# EasyEDA Pro project ProPrj_cap banks_2026-02-15.epro, board PCB1_1
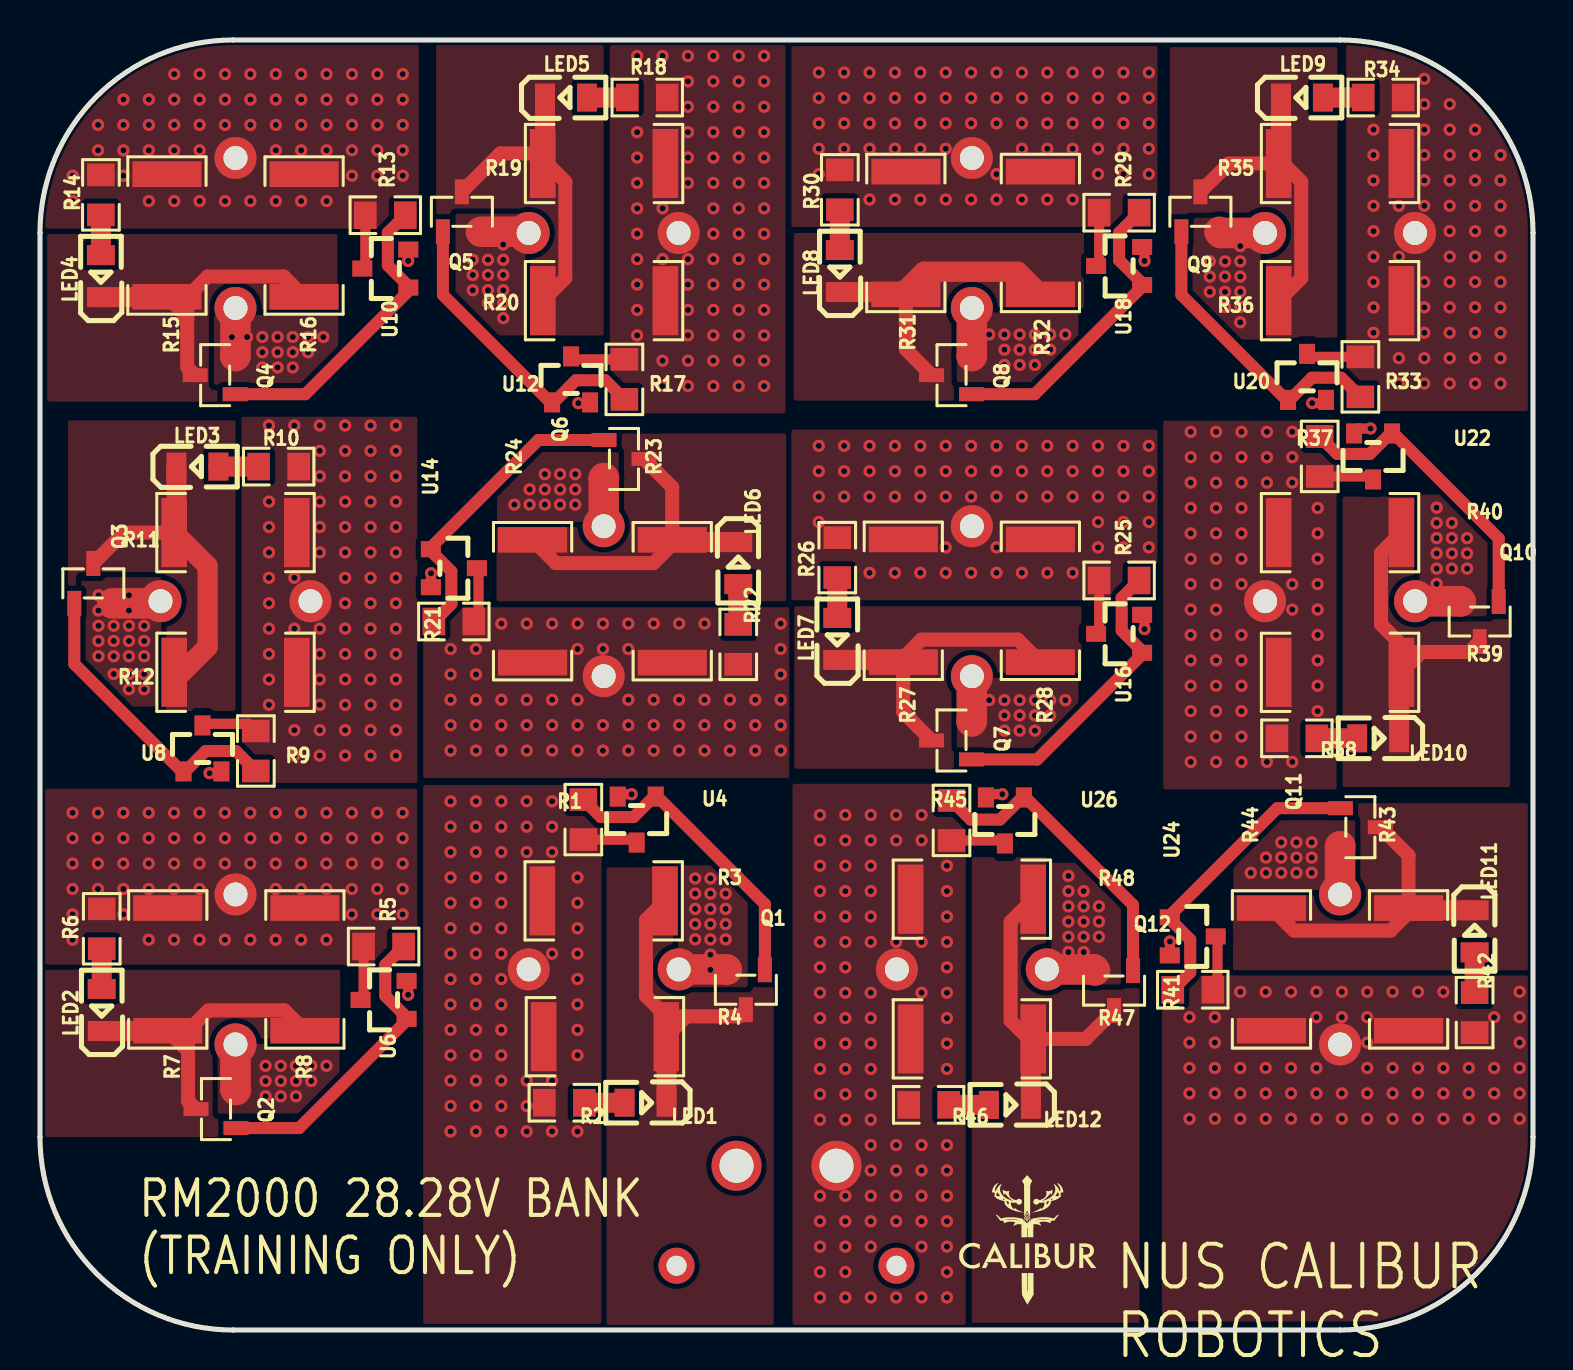
[diagram p4: board, top side]
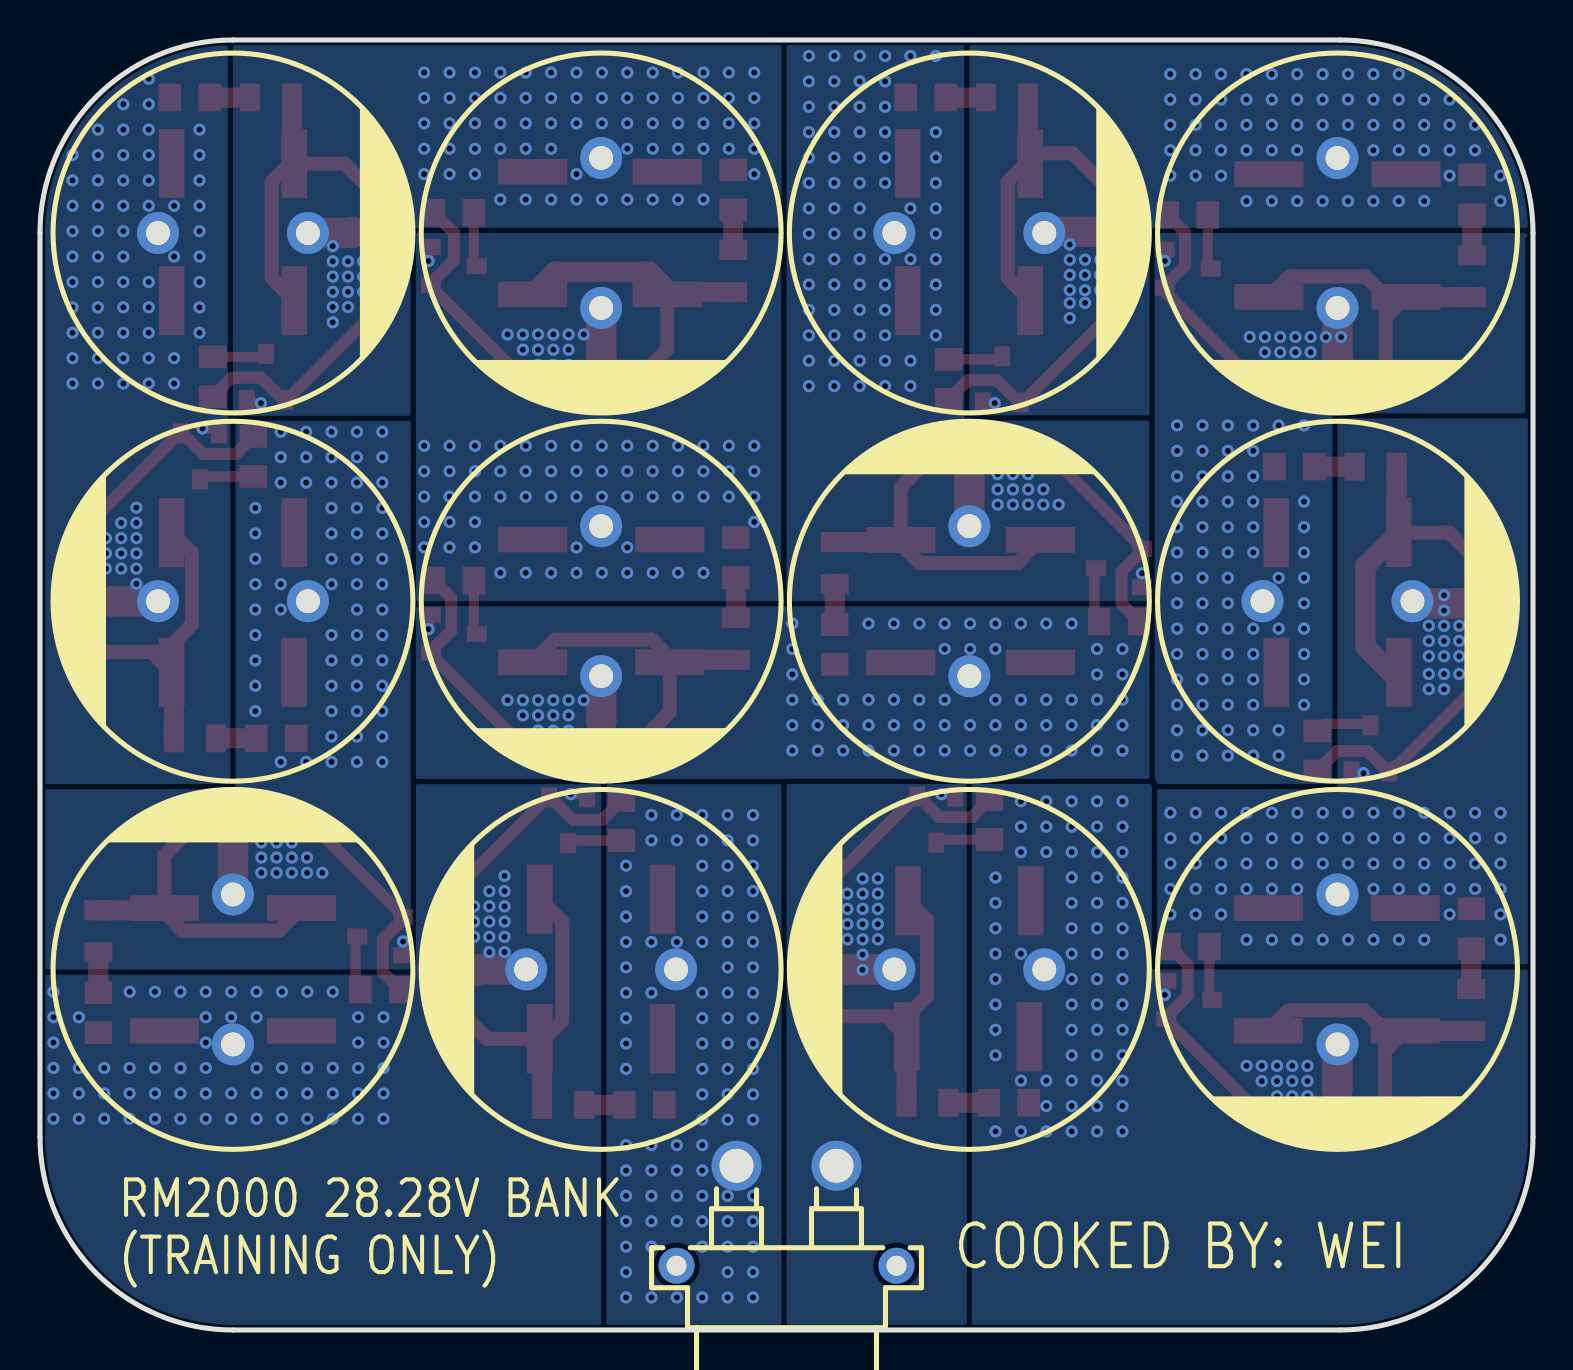
[diagram p5: board, bottom side, seen from below]

Outline 74.68 x 64.52 mm; copper layers: Top Layer, Bottom Layer. Coordinates in mm from the lower left corner of the outline.
Outline path: 0,54.86 0,9.65 arc(2.83,2.83) 9.65,0 65.02,0 arc(71.85,2.83) 74.68,9.65 74.68,54.86 arc(71.85,61.69) 65.02,64.52 9.65,64.52 arc(2.83,61.69) 0,54.86
Stack: Top Layer 0.035mm / Dielectric1 1.51mm FR4 er 4.5 / Bottom Layer 0.035mm

## Design rules (mm)
template: Custom Config
spacing copperThickness1oz (default): track to track 0.102, other pairs 0.152 to 0.3
spacing copperThickness2oz: track to track 0.203, other pairs 0.152 to 0.3
track width copperThickness1oz (default): min 0.127, default 0.508, max 2.54
track width copperThickness2oz: min 0.203, default 0.254, max 2.54
differential pair differentialPair (default): width min 0.127, default 0.254, max 2.54; gap min 0.152, default 0.152
via viaSize (default): diameter min 0.5, default 0.61, max 10; hole min 0.3, default 0.305, max 6.3
net $1N732 uses copperRegion1
net GND uses copperRegion1
net $1N2021 uses copperRegion1
net $1N2373 uses copperRegion1
net $1N2722 uses copperRegion1
net $1N3071 uses copperRegion1
net $1N3399 uses copperRegion1
net $1N3727 uses copperRegion1
net $1N4055 uses copperRegion1
net $1N4383 uses copperRegion1
net $1N4711 uses copperRegion1
net $1N5039 uses copperRegion1
net $1N5367 uses copperRegion1
net $1N3072 uses copperRegion1
net VCC uses copperRegion1
net NET1 uses copperRegion1
net NET2 uses copperRegion1
net NET3 uses copperRegion1
net NET4 uses copperRegion1
net NET5 uses copperRegion1
net NET6 uses copperRegion1
net NET7 uses copperRegion1
net NET8 uses copperRegion1
net NET9 uses copperRegion1
net NET10 uses copperRegion1
net NET11 uses copperRegion1

## Placement (name value [footprint] x y rotation side)
LED1  NCD0805R1  [LED0805-R-RD]  30.29 11.37 180 top
LED2  NCD0805R1  [LED0805-R-RD]  3.09 16 90 top
LED3  NCD0805R1  [LED0805-R-RD]  7.87 43.18 0 top
LED4  NCD0805R1  [LED0805-R-RD]  3.05 52.7 90 top
LED5  NCD0805R1  [LED0805-R-RD]  26.31 61.64 0 top
LED6  NCD0805R1  [LED0805-R-RD]  34.92 38.35 270 top
LED7  NCD0805R1  [LED0805-R-RD]  39.88 34.56 90 top
LED8  NCD0805R1  [LED0805-R-RD]  40.01 52.96 90 top
LED9  NCD0805R1  [LED0805-R-RD]  63.12 61.64 0 top
LED10  NCD0805R1  [LED0805-R-RD]  66.93 29.59 180 top
LED11  NCD0805R1  [LED0805-R-RD]  71.76 19.94 270 top
LED12  NCD0805R1  [LED0805-R-RD]  48.51 11.26 180 top
Q1  HL3400  [SOT-23-3_L2.9-W1.3-P1.90-LS2.4-BR]  35.31 17.02 90 top
Q2  HL3400  [SOT-23-3_L2.9-W1.3-P1.90-LS2.4-BR]  8.8 11.05 0 top
Q3  HL3400  [SOT-23-3_L2.9-W1.3-P1.90-LS2.4-BR]  2.67 37.34 270 top
Q4  HL3400  [SOT-23-3_L2.9-W1.3-P1.90-LS2.4-BR]  8.76 47.75 0 top
Q5  HL3400  [SOT-23-3_L2.9-W1.3-P1.90-LS2.4-BR]  21.1 55.92 270 top
Q6  HL3400  [SOT-23-3_L2.9-W1.3-P1.90-LS2.4-BR]  29.21 43.56 180 top
Q7  HL3400  [SOT-23-3_L2.9-W1.3-P1.90-LS2.4-BR]  45.59 29.48 0 top
Q8  HL3400  [SOT-23-3_L2.9-W1.3-P1.90-LS2.4-BR]  45.59 47.75 0 top
Q9  HL3400  [SOT-23-3_L2.9-W1.3-P1.90-LS2.4-BR]  58.04 55.92 270 top
Q10  HL3400  [SOT-23-3_L2.9-W1.3-P1.90-LS2.4-BR]  72.01 35.43 90 top
Q11  HL3400  [SOT-23-3_L2.9-W1.3-P1.90-LS2.4-BR]  66.04 25.15 180 top
Q12  HL3400  [SOT-23-3_L2.9-W1.3-P1.90-LS2.4-BR]  53.72 16.97 90 top
R1  30kΩ  [R0805]  27.18 25.53 270 top
R2  100Ω  [R0805]  26.23 11.37 180 top
R3  2Ω  [R2512]  28.19 21.46 180 top
R4  2Ω  [R2512]  28.26 14.67 180 top
R5  30kΩ  [R0805]  17.19 19.18 180 top
R6  100Ω  [R0805]  3.09 20.07 90 top
R7  2Ω  [R2512]  6.39 18.03 90 top
R8  2Ω  [R2512]  13.25 18.03 90 top
R9  30kΩ  [R0805]  10.8 28.96 90 top
R10  100Ω  [R0805]  11.94 43.18 0 top
R11  2Ω  [R2512]  9.78 39.88 0 top
R12  2Ω  [R2512]  9.78 32.89 0 top
R13  30kΩ  [R0805]  17.27 55.75 180 top
R14  100Ω  [R0805]  3.05 56.77 90 top
R15  2Ω  [R2512]  6.35 54.74 90 top
R16  2Ω  [R2512]  13.21 54.74 90 top
R17  30kΩ  [R0805]  29.23 47.54 90 top
R18  100Ω  [R0805]  30.37 61.64 0 top
R19  2Ω  [R2512]  28.21 58.34 0 top
R20  2Ω  [R2512]  28.21 51.48 0 top
R21  30kΩ  [R0805]  20.7 35.43 0 top
R22  100Ω  [R0805]  34.92 34.29 270 top
R23  2Ω  [R2512]  31.62 36.45 270 top
R24  2Ω  [R2512]  24.64 36.45 270 top
R25  30kΩ  [R0805]  53.97 37.48 180 top
R26  100Ω  [R0805]  39.88 38.63 90 top
R27  2Ω  [R2512]  43.18 36.47 90 top
R28  2Ω  [R2512]  50.04 36.47 90 top
R29  30kΩ  [R0805]  53.98 55.88 180 top
R30  100Ω  [R0805]  40.01 57.02 90 top
R31  2Ω  [R2512]  43.31 54.86 90 top
R32  2Ω  [R2512]  50.04 54.86 90 top
R33  30kΩ  [R0805]  66.04 47.67 90 top
R34  100Ω  [R0805]  67.18 61.64 0 top
R35  2Ω  [R2512]  65.02 58.34 0 top
R36  2Ω  [R2512]  65.02 51.48 0 top
R37  30kΩ  [R0805]  64.01 43.69 270 top
R38  100Ω  [R0805]  62.86 29.59 180 top
R39  2Ω  [R2512]  65.02 32.89 180 top
R40  2Ω  [R2512]  65.02 39.88 180 top
R41  30kΩ  [R0805]  57.66 17.02 0 top
R42  100Ω  [R0805]  71.76 15.87 270 top
R43  2Ω  [R2512]  68.45 18.03 270 top
R44  2Ω  [R2512]  61.6 18.03 270 top
R45  30kΩ  [R0805]  45.59 25.48 270 top
R46  100Ω  [R0805]  44.45 11.26 180 top
R47  2Ω  [R2512]  46.61 14.56 180 top
R48  2Ω  [R2512]  46.61 21.55 180 top
U1  XT30PW-F20.G.Y  [CONN-TH_XT30PW-F-1]  37.34 5.72 180 bottom
U2  1500uF  [CAP-TH_BD18.0-P7.50-D0.8-FD]  28.19 18.03 0 bottom
U4  LN61CN2402MR-G  [SOT-23_L2.9-W1.3-P1.90-LS2.4-BR]  29.85 25.53 90 top
U5  1500uF  [CAP-TH_BD18.0-P7.50-D0.8-FD]  9.78 18.03 270 bottom
U6  LN61CN2402MR-G  [SOT-23_L2.9-W1.3-P1.90-LS2.4-BR]  17.19 16.51 0 top
U7  1500uF  [CAP-TH_BD18.0-P7.50-D0.8-FD]  9.78 36.45 180 bottom
U8  LN61CN2402MR-G  [SOT-23_L2.9-W1.3-P1.90-LS2.4-BR]  8.13 29.08 270 top
U9  1500uF  [CAP-TH_BD18.0-P7.50-D0.8-FD]  9.78 54.86 270 bottom
U10  LN61CN2402MR-G  [SOT-23_L2.9-W1.3-P1.90-LS2.4-BR]  17.27 53.09 0 top
U11  1500uF  [CAP-TH_BD18.0-P7.50-D0.8-FD]  28.19 54.86 180 bottom
U12  LN61CN2402MR-G  [SOT-23_L2.9-W1.3-P1.90-LS2.4-BR]  26.56 47.54 270 top
U13  1500uF  [CAP-TH_BD18.0-P7.50-D0.8-FD]  28.19 36.45 90 bottom
U14  LN61CN2402MR-G  [SOT-23_L2.9-W1.3-P1.90-LS2.4-BR]  20.7 38.1 180 top
U15  1500uF  [CAP-TH_BD18.0-P7.50-D0.8-FD]  46.61 36.45 270 bottom
U16  LN61CN2402MR-G  [SOT-23_L2.9-W1.3-P1.90-LS2.4-BR]  53.97 34.82 0 top
U17  1500uF  [CAP-TH_BD18.0-P7.50-D0.8-FD]  46.61 54.86 270 bottom
U18  LN61CN2402MR-G  [SOT-23_L2.9-W1.3-P1.90-LS2.4-BR]  53.98 53.21 0 top
U19  1500uF  [CAP-TH_BD18.0-P7.50-D0.8-FD]  65.02 54.86 180 bottom
U20  LN61CN2402MR-G  [SOT-23_L2.9-W1.3-P1.90-LS2.4-BR]  63.37 47.67 270 top
U21  1500uF  [CAP-TH_BD18.0-P7.50-D0.8-FD]  65.02 36.45 0 bottom
U22  LN61CN2402MR-G  [SOT-23_L2.9-W1.3-P1.90-LS2.4-BR]  66.67 43.69 90 top
U23  1500uF  [CAP-TH_BD18.0-P7.50-D0.8-FD]  65.02 18.03 90 bottom
U24  LN61CN2402MR-G  [SOT-23_L2.9-W1.3-P1.90-LS2.4-BR]  57.66 19.68 180 top
U25  1500uF  [CAP-TH_BD18.0-P7.50-D0.8-FD]  46.61 18.03 0 bottom
U26  LN61CN2402MR-G  [SOT-23_L2.9-W1.3-P1.90-LS2.4-BR]  48.26 25.48 90 top

## Footprints (pads in the part's own frame, mm; a bottom-side part is the same pattern mirrored in y, then rotated)
CAP-TH_BD18.0-P7.50-D0.8-FD
  round 2.1 hole 1.2: 1(-3.75,0) 2(3.75,0)
CONN-TH_XT30PW-F-1
  round 2.5 hole 1.7: 1(-2.5,2.5) 2(2.5,2.5)
  round 1.8 hole 1: 3(5.5,-2.5) 4(-5.5,-2.5)
LED0805-R-RD
  rect 1x1.399 smd: 1(1.05,0) 2(-1.05,0)
R0805
  rect 1.133x1.377 smd: 1(-1,0) 2(1,0)
R2512
  rect 1.282x3.456 smd: 1(-3.067,0) 2(3.067,0)
SOT-23-3_L2.9-W1.3-P1.90-LS2.4-BR
  rect 1.25x0.7 smd: 1(1,-0.95) 2(1,0.95) 3(-1,0)
SOT-23_L2.9-W1.3-P1.90-LS2.4-BR
  rect 1x0.8 smd: 1(1.15,-0.95) 2(1.15,0.95) 3(-1.15,0)

## Nets
As in the schematic.

Pads without a net: U1 3 4

## Via types
v1: diameter 0.61, hole 0.305, Top Layer to Bottom Layer, 962 vias

## Routing (per net, layer and track width the routed paths; a pad name or vN(x,y) marks a point on that pad's centre or on a via; arc(x,y) is an arc through that point)
GND: length 3.1
  Top Layer w0.508: 28.89,26.76 28.93,26.8 v1(29.59,26.8)
  Top Layer w1.524: U2.2 34.34,18.03 Q1.2
  vias: v1(32.77,22.58) v1(32.77,21.82) v1(32.77,21.06) v1(32.77,20.3) v1(32.77,19.54) v1(33.53,22.58) v1(33.53,21.82) v1(33.53,21.06) v1(33.53,20.3) v1(33.53,19.54) v1(33.53,18.77) v1(33.53,18.01) v1(34.29,21.82) v1(34.29,21.06) v1(34.29,20.3) v1(34.29,19.54)
VCC: length 2.8
  Top Layer w0.508: R45.2 48.02,24.48 48.26,24.25
  vias: v1(39.01,25.76) v1(39.01,24.49) v1(39.01,23.22) v1(39.01,21.95) v1(39.01,20.68) v1(39.01,19.41) v1(39.01,18.14) v1(39.01,16.87) v1(39.01,15.6) v1(39.01,14.33) v1(39.01,13.06) v1(39.01,11.79) v1(39.01,10.52) v1(39.01,6.71) v1(39.01,5.44) v1(39.01,4.17) v1(39.01,2.9) v1(39.01,1.63) v1(40.28,25.76) v1(40.28,24.49) v1(40.28,23.22) v1(40.28,21.95) v1(40.28,20.68) v1(40.28,19.41) v1(40.28,18.14) v1(40.28,16.87) v1(40.28,15.6) v1(40.28,14.33) v1(40.28,13.06) v1(40.28,11.79) v1(40.28,10.52) v1(40.28,6.71) v1(40.28,5.44) v1(40.28,4.17) v1(40.28,2.9) v1(40.28,1.63) v1(41.55,25.76) v1(41.55,24.49) v1(41.55,23.22) v1(41.55,21.95) v1(41.55,20.68) v1(41.55,19.41) v1(41.55,16.87) v1(41.55,15.6) v1(41.55,14.33) v1(41.55,13.06) v1(41.55,11.79) v1(41.55,10.52) v1(41.55,9.25) v1(41.55,7.98) v1(41.55,6.71) v1(41.55,5.44) v1(41.55,4.17) v1(41.55,1.63) v1(42.82,25.76) v1(42.82,24.49) v1(42.82,19.41) v1(42.82,9.25) v1(42.82,7.98) v1(42.82,6.71) v1(42.82,5.44) v1(42.82,1.63) v1(44.09,25.76) v1(44.09,24.49) v1(44.09,19.41) v1(44.09,16.87) v1(44.09,9.25) v1(44.09,7.98) v1(44.09,6.71) v1(44.09,5.44) v1(44.09,4.17) v1(44.09,1.63) v1(45.36,23.22) v1(45.36,21.95) v1(45.36,20.68) v1(45.36,19.41) v1(45.36,18.14) v1(45.36,16.87) v1(45.36,15.6) v1(45.36,14.33) v1(45.36,13.06) v1(45.36,9.25) v1(45.36,7.98) v1(45.36,6.71) v1(45.36,5.44) v1(45.36,4.17) v1(45.36,2.9) v1(45.36,1.63)
NET1: length 5.8
  Top Layer w0.508: R1.2 29.61,24.53 29.85,24.29 ; v1(18.42,16.76) 18.42,17.45 18.42,17.46
  Top Layer w1.524: U5.2 9.78,12.02 Q2.2
  vias: v1(11.28,13.21) v1(11.28,12.45) v1(11.28,11.69) v1(12.04,13.21) v1(12.04,12.45) v1(12.04,11.69) v1(12.81,13.21) v1(12.81,12.45) v1(12.81,11.69) v1(13.57,13.21) v1(13.57,12.45) v1(14.33,13.21) v1(20.53,26.44) v1(20.53,25.17) v1(20.53,23.9) v1(20.53,22.63) v1(20.53,21.36) v1(20.53,20.09) v1(20.53,18.82) v1(20.53,17.55) v1(20.53,16.28) v1(20.53,15.01) v1(20.53,13.74) v1(20.53,12.47) v1(20.53,11.2) v1(20.53,9.93) v1(21.8,26.44) v1(21.8,25.17) v1(21.8,23.9) v1(21.8,22.63) v1(21.8,21.36) v1(21.8,20.09) v1(21.8,18.82) v1(21.8,17.55) v1(21.8,16.28) v1(21.8,15.01) v1(21.8,13.74) v1(21.8,12.47) v1(21.8,11.2) v1(21.8,9.93) v1(23.07,26.44) v1(23.07,25.17) v1(23.07,23.9) v1(23.07,22.63) v1(23.07,21.36) v1(23.07,20.09) v1(23.07,18.82) v1(23.07,17.55) v1(23.07,16.28) v1(23.07,15.01) v1(23.07,13.74) v1(23.07,12.47) v1(23.07,11.2) v1(23.07,9.93) v1(24.34,26.44) v1(24.34,25.17) v1(24.34,23.9) v1(24.34,12.47) v1(24.34,11.2) v1(24.34,9.93) v1(25.61,26.44) v1(25.61,25.17) v1(25.61,23.9) v1(25.61,18.82) v1(25.61,12.47) v1(25.61,9.93) v1(26.88,22.63) v1(26.88,21.36) v1(26.88,20.09) v1(26.88,18.82) v1(26.88,17.55) v1(26.88,16.28) v1(26.88,15.01) v1(26.88,13.74) v1(26.88,9.93)
NET2: length 5.8
  Top Layer w0.508: 15.95,16.51 16.19,16.74 R5.2 ; 9.08,27.85 v1(8.48,27.85)
  Top Layer w1.524: U7.2 5.92,36.34 Q3.2
  vias: v1(1.63,25.87) v1(1.63,24.6) v1(1.63,23.33) v1(1.63,22.06) v1(1.63,20.79) v1(1.63,19.52) v1(2.93,36.74) v1(2.93,35.98) v1(2.93,35.22) v1(2.93,34.46) v1(2.93,33.7) v1(2.9,25.87) v1(2.9,24.6) v1(2.9,23.33) v1(2.9,22.06) v1(3.69,35.22) v1(3.69,34.46) v1(3.69,33.7) v1(3.69,32.81) v1(4.17,25.87) v1(4.17,24.6) v1(4.17,23.33) v1(4.17,22.06) v1(4.17,20.79) v1(4.45,36.74) v1(4.45,35.98) v1(4.45,35.22) v1(4.45,34.46) v1(4.45,33.7) v1(4.45,32.81) v1(4.45,32.05) v1(5.21,35.22) v1(5.21,34.46) v1(5.21,33.7) v1(5.21,32.81) v1(5.21,32.05) v1(5.44,25.87) v1(5.44,24.6) v1(5.44,23.33) v1(5.44,22.06) v1(5.44,19.52) v1(6.71,25.87) v1(6.71,24.6) v1(6.71,23.33) v1(6.71,22.06) v1(6.71,19.52) v1(7.98,25.87) v1(7.98,24.6) v1(7.98,23.33) v1(7.98,22.06) v1(7.98,19.52) v1(9.25,25.87) v1(9.25,24.6) v1(9.25,23.33) v1(9.25,19.52) v1(10.52,25.87) v1(10.52,24.6) v1(10.52,23.33) v1(10.52,19.52) v1(11.79,25.87) v1(11.79,24.6) v1(11.79,23.33) v1(11.79,22.06) v1(11.79,19.52) v1(13.06,25.87) v1(13.06,24.6) v1(13.06,23.33) v1(13.06,22.06) v1(13.06,19.52) v1(14.33,25.87) v1(14.33,24.6) v1(14.33,23.33) v1(14.33,22.06) v1(14.33,19.52) v1(15.6,25.87) v1(15.6,24.6) v1(15.6,23.33) v1(15.6,22.06) v1(15.6,20.79) v1(16.87,25.87) v1(16.87,24.6) v1(16.87,23.33) v1(16.87,22.06) v1(16.87,20.79) v1(18.14,25.87) v1(18.14,24.6) v1(18.14,23.33) v1(18.14,22.06) v1(18.14,20.79)
NET3: length 5.8
  Top Layer w0.508: v1(18.42,53.47) 18.42,53.94 18.51,54.04 ; R9.2 10.43,30.32 8.13,30.32
  Top Layer w1.524: Q4.2 9.78,48.72 U9.2
  vias: v1(9.6,49.66) v1(10.36,49.66) v1(11.12,49.66) v1(11.12,48.9) v1(11.12,48.14) v1(11.45,45.24) v1(11.45,41.43) v1(11.45,40.16) v1(11.45,38.89) v1(11.45,37.62) v1(11.45,36.35) v1(11.45,35.08) v1(11.45,33.81) v1(11.45,32.54) v1(11.45,31.27) v1(11.88,49.66) v1(11.88,48.9) v1(11.88,48.14) v1(12.65,49.66) v1(12.65,48.9) v1(12.65,48.14) v1(12.72,45.24) v1(12.72,37.62) v1(12.72,35.08) v1(12.72,30) v1(12.72,28.73) v1(13.41,49.66) v1(13.41,48.9) v1(13.99,45.24) v1(13.99,43.97) v1(13.99,42.7) v1(13.99,41.43) v1(13.99,40.16) v1(13.99,38.89) v1(13.99,35.08) v1(13.99,33.81) v1(13.99,32.54) v1(13.99,31.27) v1(13.99,30) v1(13.99,28.73) v1(14.17,49.66) v1(15.26,45.24) v1(15.26,43.97) v1(15.26,42.7) v1(15.26,41.43) v1(15.26,40.16) v1(15.26,38.89) v1(15.26,37.62) v1(15.26,36.35) v1(15.26,35.08) v1(15.26,33.81) v1(15.26,32.54) v1(15.26,31.27) v1(15.26,30) v1(15.26,28.73) v1(16.53,45.24) v1(16.53,43.97) v1(16.53,42.7) v1(16.53,41.43) v1(16.53,40.16) v1(16.53,38.89) v1(16.53,37.62) v1(16.53,36.35) v1(16.53,35.08) v1(16.53,33.81) v1(16.53,32.54) v1(16.53,31.27) v1(16.53,30) v1(16.53,28.73) v1(17.8,45.24) v1(17.8,43.97) v1(17.8,42.7) v1(17.8,41.43) v1(17.8,40.16) v1(17.8,38.89) v1(17.8,37.62) v1(17.8,36.35) v1(17.8,35.08) v1(17.8,33.81) v1(17.8,32.54) v1(17.8,31.27) v1(17.8,30) v1(17.8,28.73)
NET4: length 5.8
  Top Layer w0.508: 16.04,53.09 16.27,53.32 R13.2 ; v1(26.92,46.35) 27.46,46.35 27.51,46.31
  Top Layer w1.524: U11.2 24.38,54.92 Q5.2
  vias: v1(1.63,57.73) v1(1.63,56.46) v1(2.9,60.27) v1(2.9,59) v1(4.17,61.54) v1(4.17,60.27) v1(4.17,59) v1(4.17,57.73) v1(5.44,61.54) v1(5.44,60.27) v1(5.44,59) v1(5.44,56.46) v1(6.71,62.81) v1(6.71,61.54) v1(6.71,60.27) v1(6.71,59) v1(6.71,56.46) v1(7.98,62.81) v1(7.98,61.54) v1(7.98,60.27) v1(7.98,59) v1(7.98,56.46) v1(9.25,62.81) v1(9.25,61.54) v1(9.25,60.27) v1(9.25,56.46) v1(10.52,62.81) v1(10.52,61.54) v1(10.52,60.27) v1(10.52,56.46) v1(11.79,62.81) v1(11.79,61.54) v1(11.79,60.27) v1(11.79,59) v1(11.79,56.46) v1(13.06,62.81) v1(13.06,61.54) v1(13.06,60.27) v1(13.06,59) v1(13.06,56.46) v1(14.33,62.81) v1(14.33,61.54) v1(14.33,60.27) v1(14.33,59) v1(14.33,56.46) v1(15.6,62.81) v1(15.6,61.54) v1(15.6,60.27) v1(15.6,59) v1(15.6,57.73) v1(16.87,62.81) v1(16.87,61.54) v1(16.87,60.27) v1(16.87,59) v1(16.87,57.73) v1(18.14,62.81) v1(18.14,61.54) v1(18.14,60.27) v1(18.14,59) v1(18.14,57.73) v1(21.65,53.53) v1(21.65,52.76) v1(21.65,52) v1(22.41,53.53) v1(22.41,52.76) v1(22.41,52) v1(22.41,51.37) v1(23.17,54.29) v1(23.17,53.53) v1(23.17,52.76) v1(23.17,52) v1(23.17,51.37) v1(23.17,50.6)
NET5: length 5.9
  Top Layer w0.508: 26.56,48.78 26.8,48.54 R17.2 ; v1(19.56,37.85) 19.56,37.24 19.47,37.15
  Top Layer w1.524: Q6.2 28.19,42.59 U13.2
  vias: v1(23.73,41.28) v1(24.49,42.04) v1(24.49,41.28) v1(25.25,42.8) v1(25.25,42.04) v1(25.25,41.28) v1(26.01,42.8) v1(26.01,42.04) v1(26.01,41.28) v1(26.78,42.8) v1(26.78,42.04) v1(26.78,41.28) v1(29.87,63.72) v1(29.87,59.91) v1(29.87,58.64) v1(29.87,57.37) v1(29.87,56.1) v1(29.87,54.83) v1(29.87,53.56) v1(29.87,52.29) v1(29.87,51.02) v1(29.87,49.75) v1(31.14,63.72) v1(31.14,56.1) v1(31.14,53.56) v1(31.14,48.48) v1(31.14,47.21) v1(32.41,63.72) v1(32.41,62.45) v1(32.41,61.18) v1(32.41,59.91) v1(32.41,58.64) v1(32.41,57.37) v1(32.41,53.56) v1(32.41,52.29) v1(32.41,51.02) v1(32.41,49.75) v1(32.41,48.48) v1(32.41,47.21) v1(33.68,63.72) v1(33.68,62.45) v1(33.68,61.18) v1(33.68,59.91) v1(33.68,58.64) v1(33.68,57.37) v1(33.68,56.1) v1(33.68,54.83) v1(33.68,53.56) v1(33.68,52.29) v1(33.68,51.02) v1(33.68,49.75) v1(33.68,48.48) v1(33.68,47.21) v1(34.95,63.72) v1(34.95,62.45) v1(34.95,61.18) v1(34.95,59.91) v1(34.95,58.64) v1(34.95,57.37) v1(34.95,56.1) v1(34.95,54.83) v1(34.95,53.56) v1(34.95,52.29) v1(34.95,51.02) v1(34.95,49.75) v1(34.95,48.48) v1(34.95,47.21) v1(36.22,63.72) v1(36.22,62.45) v1(36.22,61.18) v1(36.22,59.91) v1(36.22,58.64) v1(36.22,57.37) v1(36.22,56.1) v1(36.22,54.83) v1(36.22,53.56) v1(36.22,52.29) v1(36.22,51.02) v1(36.22,49.75) v1(36.22,48.48) v1(36.22,47.21)
NET6: length 5.8
  Top Layer w0.508: 55.21,35.77 55.24,35.73 v1(55.24,35.05) ; 21.94,38.1 21.94,35.67 R21.2
  Top Layer w1.524: Q7.2 46.61,30.45 U15.2
  vias: v1(20.54,34.06) v1(20.54,32.79) v1(20.54,31.52) v1(20.54,30.25) v1(20.54,28.98) v1(21.81,34.06) v1(21.81,32.79) v1(21.81,31.52) v1(21.81,30.25) v1(21.81,28.98) v1(23.08,35.33) v1(23.08,31.52) v1(23.08,30.25) v1(23.08,28.98) v1(24.35,35.33) v1(24.35,31.52) v1(24.35,30.25) v1(24.35,28.98) v1(25.62,35.33) v1(25.62,31.52) v1(25.62,30.25) v1(25.62,28.98) v1(26.89,35.33) v1(26.89,34.06) v1(26.89,31.52) v1(26.89,30.25) v1(26.89,28.98) v1(28.16,35.33) v1(28.16,34.06) v1(28.16,30.25) v1(28.16,28.98) v1(29.43,35.33) v1(29.43,34.06) v1(29.43,31.52) v1(29.43,30.25) v1(29.43,28.98) v1(30.7,35.33) v1(30.7,31.52) v1(30.7,30.25) v1(30.7,28.98) v1(31.97,35.33) v1(31.97,31.52) v1(31.97,30.25) v1(31.97,28.98) v1(33.24,35.33) v1(33.24,31.52) v1(33.24,30.25) v1(33.24,28.98) v1(34.51,31.52) v1(34.51,30.25) v1(34.51,28.98) v1(35.78,31.52) v1(35.78,30.25) v1(35.78,28.98) v1(37.05,35.33) v1(37.05,34.06) v1(37.05,32.79) v1(37.05,31.52) v1(37.05,30.25) v1(37.05,28.98) v1(47.48,31.5) v1(48.24,31.5) v1(48.24,30.74) v1(48.24,29.98) v1(49,31.5) v1(49,30.74) v1(49,29.98) v1(49.76,31.5) v1(49.76,30.74) v1(49.76,29.98) v1(50.52,31.5) v1(50.52,30.74) v1(51.29,31.5)
NET7: length 5.9
  Top Layer w0.508: R25.2 52.97,35.05 52.74,34.82 ; v1(55.24,53.47) 55.24,54.13 55.21,54.16
  Top Layer w1.524: U17.2 46.61,48.72 Q8.2
  vias: v1(38.95,44.22) v1(38.95,42.95) v1(38.95,41.68) v1(38.95,40.41) v1(40.22,44.22) v1(40.22,42.95) v1(40.22,41.68) v1(41.49,44.22) v1(41.49,42.95) v1(41.49,41.68) v1(41.49,37.87) v1(42.76,44.22) v1(42.76,42.95) v1(42.76,41.68) v1(42.76,37.87) v1(44.03,44.22) v1(44.03,42.95) v1(44.03,41.68) v1(44.03,37.87) v1(45.3,44.22) v1(45.3,42.95) v1(45.3,41.68) v1(45.3,39.14) v1(45.3,37.87) v1(46.57,44.22) v1(46.57,42.95) v1(46.57,41.68) v1(46.57,37.87) v1(47.48,49.79) v1(47.84,44.22) v1(47.84,42.95) v1(47.84,41.68) v1(47.84,39.14) v1(47.84,37.87) v1(48.24,49.79) v1(48.24,49.03) v1(48.24,48.26) v1(49,49.79) v1(49,49.03) v1(49,48.26) v1(49.11,44.22) v1(49.11,42.95) v1(49.11,41.68) v1(49.11,37.87) v1(49.76,49.79) v1(49.76,49.03) v1(49.76,48.26) v1(50.38,44.22) v1(50.38,42.95) v1(50.38,41.68) v1(50.38,37.87) v1(50.52,49.79) v1(50.52,49.03) v1(51.29,49.79) v1(51.65,44.22) v1(51.65,42.95) v1(51.65,41.68) v1(51.65,37.87) v1(52.92,44.22) v1(52.92,42.95) v1(52.92,41.68) v1(52.92,40.41) v1(52.92,39.14) v1(54.19,44.22) v1(54.19,42.95) v1(54.19,41.68) v1(54.19,40.41) v1(54.19,39.14) v1(55.46,44.22) v1(55.46,42.95) v1(55.46,41.68) v1(55.46,40.41) v1(55.46,39.14)
NET8: length 5.8
  Top Layer w0.508: 52.74,53.21 52.98,53.45 R29.2 ; v1(63.63,46.35) 64.24,46.35 64.32,46.43
  Top Layer w1.524: U19.2 59.05,54.86 Q9.2
  vias: v1(38.95,62.89) v1(38.95,61.62) v1(38.95,60.35) v1(38.95,59.08) v1(38.95,57.81) v1(40.22,62.89) v1(40.22,61.62) v1(40.22,60.35) v1(40.22,59.08) v1(41.49,62.89) v1(41.49,61.62) v1(41.49,60.35) v1(41.49,59.08) v1(41.49,56.54) v1(42.76,62.89) v1(42.76,61.62) v1(42.76,60.35) v1(42.76,59.08) v1(42.76,56.54) v1(44.03,62.89) v1(44.03,61.62) v1(44.03,60.35) v1(44.03,59.08) v1(44.03,56.54) v1(45.3,62.89) v1(45.3,61.62) v1(45.3,60.35) v1(45.3,59.08) v1(45.3,56.54) v1(46.57,62.89) v1(46.57,61.62) v1(46.57,60.35) v1(46.57,56.54) v1(47.84,62.89) v1(47.84,61.62) v1(47.84,60.35) v1(47.84,57.81) v1(47.84,56.54) v1(49.11,62.89) v1(49.11,61.62) v1(49.11,60.35) v1(49.11,59.08) v1(49.11,56.54) v1(50.38,62.89) v1(50.38,61.62) v1(50.38,60.35) v1(50.38,59.08) v1(50.38,56.54) v1(51.65,62.89) v1(51.65,61.62) v1(51.65,60.35) v1(51.65,59.08) v1(51.65,56.54) v1(52.92,62.89) v1(52.92,61.62) v1(52.92,60.35) v1(52.92,59.08) v1(52.92,57.81) v1(54.19,62.89) v1(54.19,61.62) v1(54.19,60.35) v1(54.19,59.08) v1(54.19,57.81) v1(55.46,62.89) v1(55.46,61.62) v1(55.46,60.35) v1(55.46,59.08) v1(55.46,57.81) v1(58.51,53.45) v1(58.51,52.68) v1(58.51,51.92) v1(59.27,53.45) v1(59.27,52.68) v1(59.27,51.92) v1(59.27,51.16) v1(60.03,54.21) v1(60.03,53.45) v1(60.03,52.68) v1(60.03,51.92) v1(60.03,51.16) v1(60.03,50.4)
NET9: length 5.9
  Top Layer w0.508: v1(66.55,45.08) 65.89,45.08 65.73,44.92 ; 63.37,48.9 63.61,48.67 R33.2
  Top Layer w1.524: Q10.2 71.04,36.45 U21.2
  vias: v1(66.7,60.03) v1(66.7,58.76) v1(66.7,57.49) v1(66.7,56.22) v1(66.7,54.95) v1(66.7,53.68) v1(66.7,52.41) v1(66.7,51.14) v1(66.7,49.87) v1(67.97,56.22) v1(67.97,53.68) v1(67.97,48.6) v1(67.97,47.33) v1(69.24,62.57) v1(69.24,61.3) v1(69.24,60.03) v1(69.24,58.76) v1(69.24,57.49) v1(69.24,56.22) v1(69.24,52.41) v1(69.24,51.14) v1(69.24,49.87) v1(69.24,48.6) v1(69.24,47.33) v1(69.85,41.13) v1(69.85,40.36) v1(69.85,39.6) v1(69.85,38.84) v1(69.85,38.08) v1(69.85,37.32) v1(70.51,61.3) v1(70.51,60.03) v1(70.51,58.76) v1(70.51,57.49) v1(70.51,56.22) v1(70.51,54.95) v1(70.51,53.68) v1(70.51,52.41) v1(70.51,51.14) v1(70.51,49.87) v1(70.51,48.6) v1(70.51,47.33) v1(70.62,40.36) v1(70.62,39.6) v1(70.62,38.84) v1(70.62,38.08) v1(71.38,39.6) v1(71.38,38.84) v1(71.38,38.08) v1(71.78,60.03) v1(71.78,58.76) v1(71.78,57.49) v1(71.78,56.22) v1(71.78,54.95) v1(71.78,53.68) v1(71.78,52.41) v1(71.78,51.14) v1(71.78,49.87) v1(71.78,48.6) v1(71.78,47.33) v1(73.05,58.76) v1(73.05,57.49) v1(73.05,56.22) v1(73.05,54.95) v1(73.05,53.68) v1(73.05,52.41) v1(73.05,51.14) v1(73.05,49.87) v1(73.05,48.6) v1(73.05,47.33)
NET10: length 5.9
  Top Layer w0.508: 56.42,18.73 56.52,18.83 v1(56.52,19.43) ; 66.67,42.45 66.44,42.69 R37.2
  Top Layer w1.524: U23.2 65.02,24.18 Q11.2
  vias: v1(57.55,44.92) v1(57.55,43.65) v1(57.55,42.38) v1(57.55,41.11) v1(57.55,39.84) v1(57.55,38.57) v1(57.55,37.3) v1(57.55,36.03) v1(57.55,34.76) v1(57.55,33.49) v1(57.55,32.22) v1(57.55,30.95) v1(57.55,29.68) v1(57.55,28.41) v1(58.82,44.92) v1(58.82,43.65) v1(58.82,42.38) v1(58.82,41.11) v1(58.82,39.84) v1(58.82,38.57) v1(58.82,37.3) v1(58.82,36.03) v1(58.82,34.76) v1(58.82,33.49) v1(58.82,32.22) v1(58.82,30.95) v1(58.82,29.68) v1(58.82,28.41) v1(60.09,44.92) v1(60.09,43.65) v1(60.09,42.38) v1(60.09,41.11) v1(60.09,39.84) v1(60.09,38.57) v1(60.09,37.3) v1(60.09,34.76) v1(60.09,33.49) v1(60.09,32.22) v1(60.09,30.95) v1(60.09,29.68) v1(60.09,28.41) v1(60.56,22.86) v1(61.32,23.63) v1(61.32,22.86) v1(61.36,44.92) v1(61.36,43.65) v1(61.36,42.38) v1(61.36,28.41) v1(62.08,24.39) v1(62.08,23.63) v1(62.08,22.86) v1(62.63,44.92) v1(62.63,43.65) v1(62.63,42.38) v1(62.63,37.3) v1(62.63,36.03) v1(62.63,28.41) v1(62.84,24.39) v1(62.84,23.63) v1(62.84,22.86) v1(63.61,24.39) v1(63.61,23.63) v1(63.61,22.86) v1(63.9,41.11) v1(63.9,39.84) v1(63.9,38.57) v1(63.9,37.3) v1(63.9,36.03) v1(63.9,34.76) v1(63.9,33.49) v1(63.9,32.22) v1(63.9,30.95)
NET11: length 6.1
  Top Layer w0.508: v1(48.13,26.8) 47.39,26.8 47.31,26.72 ; 58.89,19.68 58.89,17.25 R41.2
  Top Layer w1.524: U25.2 52.71,18.03 Q12.2
  vias: v1(51.44,22.71) v1(51.44,21.95) v1(51.44,21.19) v1(51.44,20.43) v1(51.44,19.66) v1(51.44,18.9) v1(52.2,21.95) v1(52.2,21.19) v1(52.2,20.43) v1(52.2,19.66) v1(52.2,18.9) v1(52.96,21.19) v1(52.96,20.43) v1(52.96,19.66) v1(57.49,15.64) v1(57.49,14.37) v1(57.49,13.1) v1(57.49,11.83) v1(57.49,10.56) v1(58.76,15.64) v1(58.76,14.37) v1(58.76,13.1) v1(58.76,11.83) v1(58.76,10.56) v1(60.03,16.91) v1(60.03,13.1) v1(60.03,11.83) v1(60.03,10.56) v1(61.3,16.91) v1(61.3,13.1) v1(61.3,11.83) v1(61.3,10.56) v1(62.57,16.91) v1(62.57,13.1) v1(62.57,11.83) v1(62.57,10.56) v1(63.84,16.91) v1(63.84,15.64) v1(63.84,13.1) v1(63.84,11.83) v1(63.84,10.56) v1(65.11,16.91) v1(65.11,15.64) v1(65.11,11.83) v1(65.11,10.56) v1(66.38,16.91) v1(66.38,15.64) v1(66.38,14.37) v1(66.38,13.1) v1(66.38,11.83) v1(66.38,10.56) v1(67.65,16.91) v1(67.65,13.1) v1(67.65,11.83) v1(67.65,10.56) v1(68.92,16.91) v1(68.92,13.1) v1(68.92,11.83) v1(68.92,10.56) v1(70.19,16.91) v1(70.19,13.1) v1(70.19,11.83) v1(70.19,10.56) v1(71.46,13.1) v1(71.46,11.83) v1(71.46,10.56) v1(72.73,15.64) v1(72.73,13.1) v1(72.73,11.83) v1(72.73,10.56) v1(74,16.91) v1(74,15.64) v1(74,14.37) v1(74,13.1) v1(74,11.83) v1(74,10.56)
$1N471: length 2
  Top Layer w1: LED1.1 R2.1
$1N732: length 15.5
  Top Layer w0.7: 32.34,15.68 31.32,15.68 30.31,16.7 30.31,20.51 R3.1 ; 32.34,15.68 R4.1 ; 32.34,15.68 34.97,15.68 Q1.3
  Top Layer w1: R4.1 31.34,14.65 LED1.2
$1N777: length 15.4
  Top Layer w0.6: R1.1 28.05,25.65 29.69,25.65 30.8,26.76 36.26,21.3 Q1.1
$1N2020: length 2
  Top Layer w1: LED2.1 R6.1
$1N2021: length 15.5
  Top Layer w0.7: R8.1 12.23,15.98 8.42,15.98 7.41,14.97 7.41,13.95 ; R7.1 7.41,13.95 ; 7.41,13.95 7.41,11.45 Q2.3
  Top Layer w1: LED2.2 6.37,14.95 R7.1
$1N2022: length 15.4
  Top Layer w0.6: Q2.1 12.96,10.1 18.42,15.56 17.27,16.71 17.27,18.26 R5.1
$1N2372: length 2
  Top Layer w1: LED3.1 R10.1
$1N2373: length 16.6
  Top Layer w0.7: Q3.3 4.21,39.88 R11.1
  Top Layer w1: R11.1 6.82,39.99 LED3.2
  Top Layer w1.016: R11.1 8.38,38.21 8.38,34.16 7.11,32.89 R12.1
$1N2374: length 15.2
  Top Layer w0.6: R9.1 9.8,28.96 8.28,28.96 7.18,27.85 1.72,33.31 Q3.1
$1N2721: length 2
  Top Layer w1: LED4.1 R14.1
$1N2722: length 15.5
  Top Layer w0.7: R16.1 12.19,52.69 8.38,52.69 7.37,51.67 7.37,50.65 ; Q4.3 7.37,48.15 7.37,50.65 ; 7.37,50.65 R15.1
  Top Layer w1: R15.1 6.33,51.65 LED4.2
$1N2723: length 15.5
  Top Layer w0.6: Q4.1 13.27,46.8 18.51,52.03 18.51,52.14 17.4,53.24 17.4,54.88 R13.1
$1N3070: length 2
  Top Layer w1: LED5.1 R18.1
$1N3071: length 16.3
  Top Layer w0.7: R19.1 24.64,58.84 23.02,58.84 Q5.3 ; 25.26,58.45 26.27,57.43 26.27,52.61 R20.1
  Top Layer w1: R19.1 25.26,58.45 LED5.2
$1N3072: length 15.4
  Top Layer w0.6: Q5.1 20.15,51.77 25.61,46.31 26.8,47.5 28.27,47.5 R17.1
$1N3398: length 2
  Top Layer w1: LED6.1 R22.1
$1N3399: length 16
  Top Layer w0.7: Q6.3 31.62,42.15 R23.1 ; 31.73,39.4 30.68,38.35 25.8,38.35 R24.1
  Top Layer w1: LED6.2 31.73,39.4 R23.1
$1N3400: length 15.4
  Top Layer w0.6: R21.1 20.57,36.31 20.57,37.94 19.47,39.05 24.93,44.51 Q6.1
$1N3726: length 2
  Top Layer w1: LED7.1 R26.1
$1N3727: length 15.7
  Top Layer w0.7: 43.07,33.51 44.08,34.53 48.91,34.53 R28.1 ; R27.1 43.18,30.9 Q7.3
  Top Layer w1: R27.1 43.07,33.51 LED7.2
$1N3728: length 15.3
  Top Layer w0.6: Q7.1 49.88,28.53 55.21,33.87 54.1,34.97 54.1,36.61 R25.1
$1N4054: length 2
  Top Layer w1: LED8.1 R30.1
$1N4055: length 15.7
  Top Layer w0.7: Q8.3 43.31,49.04 R31.1
  Top Layer w1: LED8.2 43.2,51.91 R31.1
  Top Layer w1.016: R32.1 48.91,52.92 44.21,52.92 43.2,51.91
$1N4056: length 15.4
  Top Layer w0.6: Q8.1 49.75,46.8 55.21,52.26 53.98,53.5 53.98,54.88 R29.1
$1N4382: length 2
  Top Layer w1: LED9.1 R34.1
$1N4383: length 15.7
  Top Layer w0.7: R35.1 59.45,58.34 Q9.3 ; R36.1 63.08,52.61 63.08,57.43 62.07,58.45
  Top Layer w1: R35.1 62.07,58.45 LED9.2
$1N4384: length 15.2
  Top Layer w0.6: Q9.1 57.09,51.77 62.42,46.43 63.61,47.62 65.08,47.62 R33.1
$1N4710: length 2
  Top Layer w1: LED10.1 R38.1
$1N4711: length 15.5
  Top Layer w0.7: R40.1 67.07,38.86 67.07,35.29 68.45,33.91 69.11,33.91 ; R39.1 69.11,33.91 ; 69.11,33.91 71.48,33.91 Q10.3
  Top Layer w1: LED10.2 67.98,32.78 R39.1
$1N4712: length 15.1
  Top Layer w0.6: R37.1 64.88,43.81 66.52,43.81 67.63,44.92 72.96,39.59 Q10.1
$1N5038: length 2
  Top Layer w1: LED11.1 R42.1
$1N5039: length 15.8
  Top Layer w0.7: R43.1 68.45,23.73 Q11.3 ; 68.56,20.99 67.55,19.97 62.72,19.97 R44.1
  Top Layer w1: LED11.2 68.56,20.99 R43.1
$1N5040: length 15.3
  Top Layer w0.6: R41.1 57.53,17.89 57.53,19.53 56.42,20.63 61.88,26.1 Q11.1
$1N5366: length 2
  Top Layer w1: 47.46,11.26 R46.1
$1N5367: length 16
  Top Layer w0.7: Q12.3 52.31,14.56 R47.1 ; R48.1 48.55,20.42 48.55,15.47 49.56,14.45
  Top Layer w1: R47.1 49.56,14.45 LED12.2
$1N5368: length 15.5
  Top Layer w0.6: Q12.1 54.67,21.26 49.21,26.72 48.02,25.53 46.55,25.53 R45.1

## Copper pours and planes (outline as drawn; the poured copper is in the pictures)
GND on Top Layer: 31.91,23.24 35.4,23.24 35.4,17.15 31.91,17.15
GND on Bottom Layer: 28.32,27.3 37.34,27.3 37.34,0.11 28.32,0.11
VCC on Top Layer: 46.31,27.32 46.31,0.24 37.64,0.24 37.64,27.32
VCC on Bottom Layer: 37.59,27.3 46.36,27.3 46.36,0.25 37.59,0.25
NET1 on Top Layer: 19.16,0.31 19.16,27.25 28.08,27.25 28.08,0.31
NET1 on Top Layer: 8.89,10.82 8.89,14.32 14.98,14.32 14.98,10.82
NET1 on Bottom Layer: 28.32,27.3 28.32,0.25 0.89,0.25 -0.76,1.91 -0.76,18.03 19.06,18.03 19.06,27.29 19.05,27.3
NET2 on Top Layer: 2.06,37.65 6.07,37.65 6.07,31.18 2.06,31.18
NET2 on Top Layer: 0.18,27.07 18.87,27.07 18.87,18.27 0.18,18.27
NET2 on Bottom Layer: 19.05,27.05 19.05,18.03 0.25,18.03 0.25,45.59 9.78,45.59 9.78,27.05
NET3 on Top Layer: 8.7,47.27 8.7,50.77 14.92,50.77 14.92,47.27
NET3 on Top Layer: 10.08,27.36 10.08,45.67 18.87,45.67 18.87,27.36
NET3 on Bottom Layer: 18.92,27.3 18.92,54.86 0.13,54.86 0.38,54.61 0.38,45.59 9.91,45.59 9.91,27.26 18.88,27.26
NET4 on Top Layer: 20.78,55.83 24.28,55.83 24.28,49.74 20.78,49.74
NET4 on Top Layer: 0.25,64.26 18.95,64.26 18.95,55.09 0.25,55.09
NET4 on Bottom Layer: 0.25,54.86 0.25,65.4 27.69,65.4 28.19,64.9 28.19,45.74 19.18,45.74 19.18,54.99 0.38,54.99
NET5 on Top Layer: 28.5,45.83 28.5,64.27 37.29,64.27 37.29,45.83
NET5 on Top Layer: 22.86,40.42 22.86,43.91 28.95,43.91 28.95,40.42
NET5 on Bottom Layer: 28.32,64.26 37.34,64.26 37.34,36.45 19.19,36.45 19.19,45.58 19.18,45.59 28.32,54.74
NET6 on Top Layer: 37.48,27.61 19.17,27.61 19.17,36.15 37.48,36.15
NET6 on Top Layer: 45.85,29.11 45.85,32.61 51.94,32.61 51.94,29.11
NET6 on Bottom Layer: 19.05,36.19 55.88,36.19 55.88,27.56 19.05,27.56
NET7 on Top Layer: 55.89,36.5 37.58,36.5 37.58,45.04 55.89,45.04
NET7 on Top Layer: 45.85,47.4 45.85,50.9 51.94,50.9 51.94,47.4
NET7 on Bottom Layer: 37.61,54.86 55.88,54.86 55.88,36.45 37.61,36.45
NET8 on Top Layer: 57.56,55.62 61.06,55.62 61.06,49.53 57.56,49.53
NET8 on Top Layer: 55.89,55.17 37.58,55.17 37.58,64.21 55.89,64.21
NET8 on Bottom Layer: 65.02,64.26 65.02,45.72 56.01,45.72 56.01,54.86 37.59,54.86 37.46,54.99 37.46,64.26
NET9 on Top Layer: 68.99,41.78 72.49,41.78 72.49,35.69 68.99,35.69
NET9 on Top Layer: 74.5,64.27 74.5,45.96 65.33,45.96 65.33,64.27
NET9 on Bottom Layer: 65.15,64.26 74.42,64.26 74.42,27.3 65.15,27.3
NET10 on Top Layer: 64.85,45.48 64.85,27.04 56.18,27.04 56.18,45.48
NET10 on Top Layer: 59.69,22 59.69,25.5 65.78,25.5 65.78,22
NET10 on Bottom Layer: 56.13,45.59 74.55,45.59 74.55,18.03 56.13,18.03
NET11 on Top Layer: 50.58,23.36 54.07,23.36 54.07,17.28 50.58,17.28
NET11 on Top Layer: 74.43,0.43 56.12,0.43 56.12,17.73 74.43,17.73
NET11 on Bottom Layer: 46.61,27.3 76.96,27.3 76.96,-4.45 46.61,-4.45
$1N732 on Top Layer: 28.32,23.14 36.7,23.14 36.7,0.23 28.32,0.23
$1N2021 on Top Layer: 0.23,9.65 0.23,18.03 15.01,18.03 15.01,9.65
$1N2373 on Top Layer: 1.4,45.49 9.78,45.49 9.78,30.96 1.4,30.96
$1N2722 on Top Layer: 0.36,46.43 0.36,54.81 14.88,54.81 14.88,46.43
$1N3071 on Top Layer: 19.81,64.26 28.19,64.26 28.19,49.74 19.81,49.74
$1N3399 on Top Layer: 22.84,36.45 22.84,44.83 37.36,44.83 37.36,36.45
$1N3727 on Top Layer: 37.7,28.07 37.7,36.19 52.09,36.19 52.09,28.07
$1N4055 on Top Layer: 37.7,46.48 37.7,54.86 52.22,54.86 52.22,46.48
$1N4383 on Top Layer: 56.52,64.16 64.9,64.16 64.9,49.63 56.52,49.63
$1N4711 on Top Layer: 65.15,41.68 73.53,41.68 73.53,27.15 65.15,27.15
$1N5039 on Top Layer: 59.67,17.97 59.67,26.35 74.45,26.35 74.45,17.97
$1N5367 on Top Layer: 46.61,23.65 54.99,23.65 54.99,0.36 46.61,0.36

## Text on the board
Bottom Silkscreen Layer: RM2000 28.28V BANK / (TRAINING ONLY) | COOKED BY: WEI
Top Silkscreen Layer: RM2000 28.28V BANK / (TRAINING ONLY) | NUS CALIBUR / ROBOTICS
